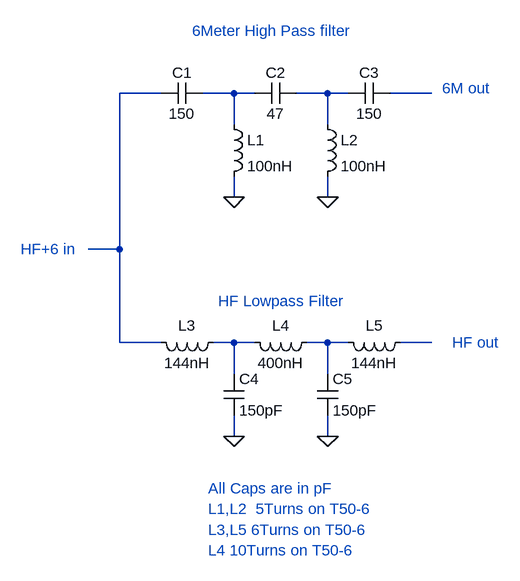
[diagram p0: schematic HF-6 Diplexer.asc]
HF-6 Diplexer.asc, the LTspice schematic file:
Version 4
SHEET 1 880 880
WIRE -160 400 -208 400
WIRE -160 400 -160 160
WIRE -160 544 -160 400
WIRE -96 160 -160 160
WIRE -96 544 -160 544
WIRE 16 160 -32 160
WIRE 16 208 16 160
WIRE 16 320 16 288
WIRE 16 544 -16 544
WIRE 16 592 16 544
WIRE 16 688 16 656
WIRE 48 160 16 160
WIRE 48 544 16 544
WIRE 160 160 112 160
WIRE 160 208 160 160
WIRE 160 320 160 288
WIRE 160 544 128 544
WIRE 160 592 160 544
WIRE 160 688 160 656
WIRE 192 160 160 160
WIRE 192 544 160 544
WIRE 320 160 256 160
WIRE 320 544 272 544
FLAG 16 320 0
FLAG 160 320 0
FLAG 16 688 0
FLAG 160 688 0
SYMBOL cap -32 144 R90
WINDOW 0 0 32 VBottom 0
WINDOW 3 32 32 VTop 0
SYMATTR InstName C1
SYMATTR Value 150
SYMBOL cap 112 144 R90
WINDOW 0 0 32 VBottom 0
WINDOW 3 32 32 VTop 0
SYMATTR InstName C2
SYMATTR Value 47
SYMBOL ind 0 192 R0
SYMATTR InstName L1
SYMATTR Value 100nH
SYMBOL ind 144 192 R0
SYMATTR InstName L2
SYMATTR Value 100nH
SYMBOL cap 256 144 R90
WINDOW 0 0 32 VBottom 0
WINDOW 3 32 32 VTop 0
SYMATTR InstName C3
SYMATTR Value 150
SYMBOL ind 0 528 R90
WINDOW 0 5 56 VBottom 0
WINDOW 3 32 56 VTop 0
SYMATTR InstName L3
SYMATTR Value 144nH
SYMBOL ind 144 528 R90
WINDOW 0 5 56 VBottom 0
WINDOW 3 32 56 VTop 0
SYMATTR InstName L4
SYMATTR Value 400nH
SYMBOL ind 288 528 R90
WINDOW 0 5 56 VBottom 0
WINDOW 3 32 56 VTop 0
SYMATTR InstName L5
SYMATTR Value 144nH
SYMBOL cap 0 592 R0
SYMATTR InstName C4
SYMATTR Value 150pF
SYMBOL cap 144 592 R0
SYMATTR InstName C5
SYMATTR Value 150pF
TEXT -48 64 Left 0 ;6Meter High Pass filter
TEXT -8 480 Left 0 ;HF Lowpass Filter
TEXT -312 400 Left 0 ;HF+6 in
TEXT 336 152 Left 0 ;6M out
TEXT 352 544 Left 0 ;HF out
TEXT -24 768 Left 0 ;All Caps are in pF
TEXT -24 800 Left 0 ;L1,L2  5Turns on T50-6
TEXT -24 832 Left 0 ;L3,L5 6Turns on T50-6
TEXT -24 864 Left 0 ;L4 10Turns on T50-6

The netlist it stands for:
* HF-6 Diplexer.asc
C1 N002 N001 150
C2 N004 N002 47
L1 N002 0 100nH
L2 N004 0 100nH
C3 N006 N004 150
L3 N003 N001 144nH
L4 N005 N003 400nH
L5 N007 N005 144nH
C4 N003 0 150pF
C5 N005 0 150pF
* 6Meter High Pass filter
* HF Lowpass Filter
* HF+6 in
* 6M out
* HF out
* All Caps are in pF
* L1,L2  5Turns on T50-6
* L3,L5 6Turns on T50-6
* L4 10Turns on T50-6
.backanno
.end